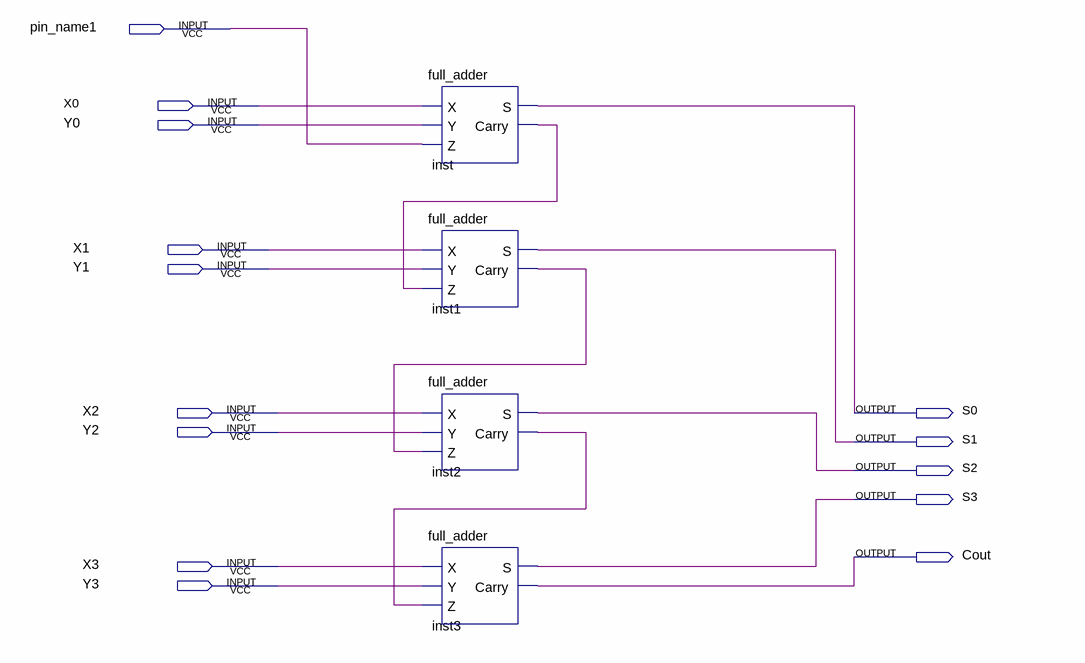
[diagram p0: schematic sheet]
// Quartus schematic fourbit_rippleCarryAdder.bdf as structural Verilog: 4 symbols, 14 pins
module fourbit_rippleCarryAdder (
  input  pin_name1,
  input  X0,
  input  Y0,
  input  X1,
  input  Y1,
  input  X2,
  input  Y2,
  input  X3,
  input  Y3,
  output S0,
  output S1,
  output S2,
  output S3,
  output Cout
);

  wire inst1_carry, inst2_carry, inst_carry;

  full_adder inst (.X(X0), .Y(Y0), .Z(pin_name1), .S(S0), .Carry(inst_carry));
  full_adder inst1 (.X(X1), .Y(Y1), .Z(inst_carry), .S(S1), .Carry(inst1_carry));
  full_adder inst2 (.X(X2), .Y(Y2), .Z(inst1_carry), .S(S2), .Carry(inst2_carry));
  full_adder inst3 (.X(X3), .Y(Y3), .Z(inst2_carry), .S(S3), .Carry(Cout));
endmodule
